# Altium project ImechE project.PrjPcb
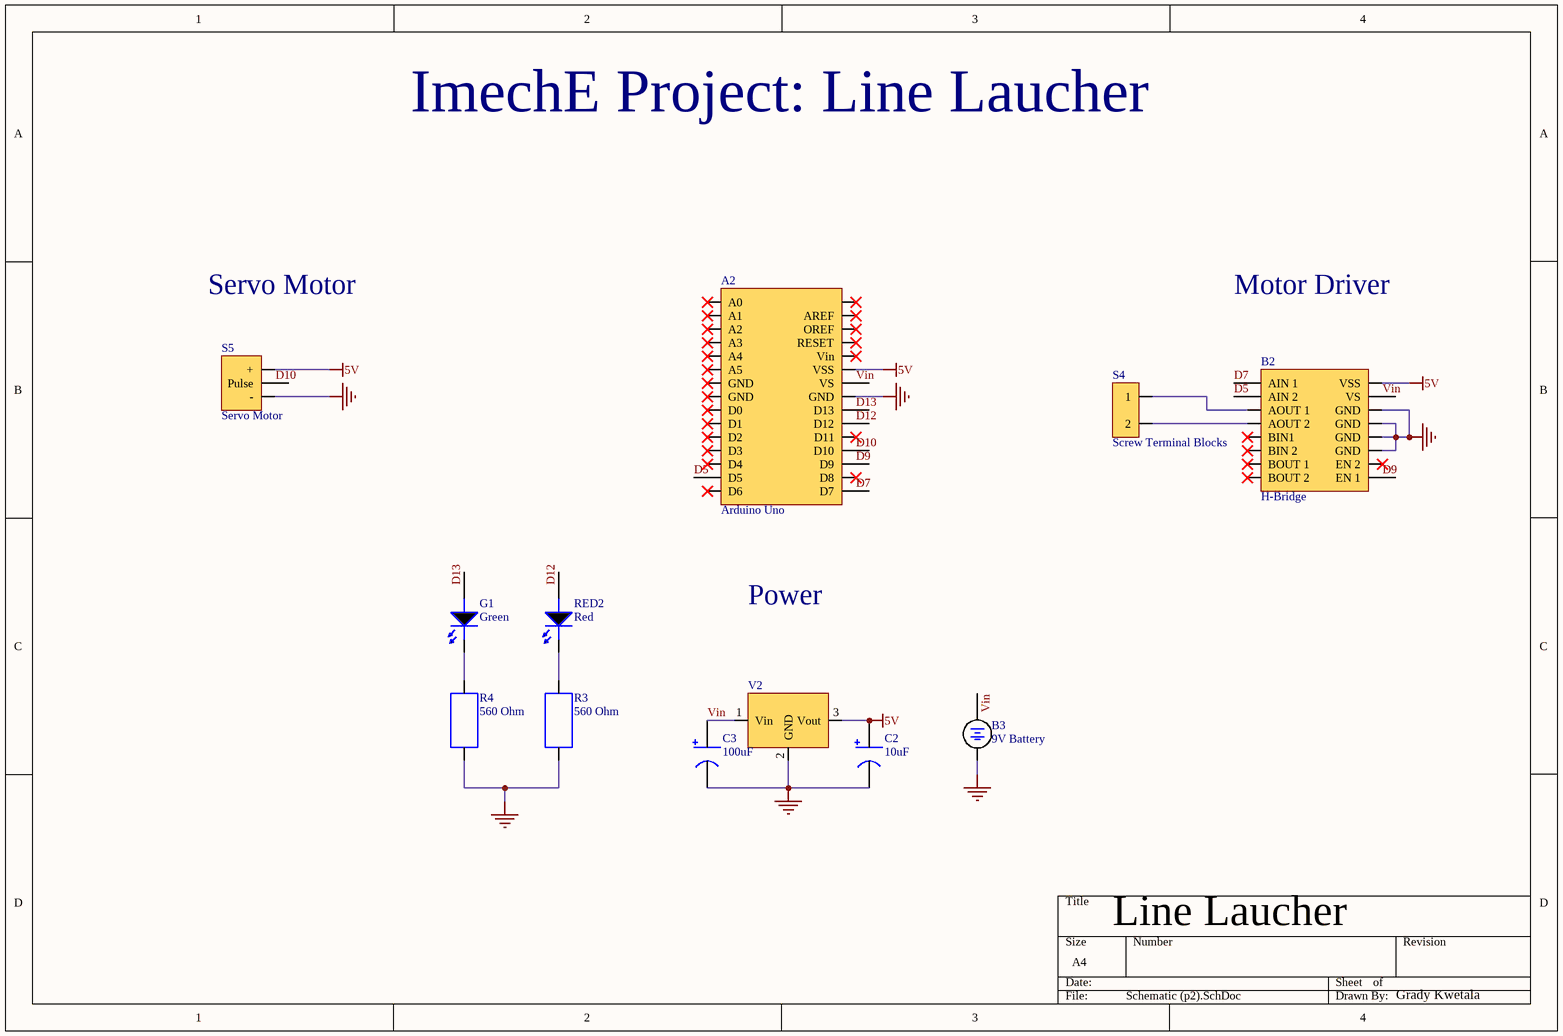
[diagram p0: Schematic (p2).SchDoc]
1 sheet, 12 parts. Net scope: global (net labels, ports and power ports of the same name join across sheets).
Board files: PCB.PcbDoc, PCB (p2).PcbDoc

## Sheet Schematic (p2).SchDoc
size A4

### Parts
A2  Arduino Uno  [Arduino Uno]
B2  H-Bridge  [H-Bridge]
B3  9V Battery  [9V Battery]
C2  10uF  [10uF]
C3  100uF  [100uF]
G1  Green  [Green]
R3  560 Ohm  [560]
R4  560 Ohm  [560]
RED2  Red  [RED]
S4  Screw Terminal Blocks  [Screw]
S5  Servo Motor  [Servo Motor]
V2  Voltage Regular  [Voltage regulator]  (value not drawn)

### Nets
5V: A2.25(VSS) B2.16(VSS) C2.2 S5.1(+) V2.3(Vout)
GND: A2.23(GND) B2.11(GND) B2.12(GND) B2.13(GND) B2.14(GND) B3.2(-) C2.1 C3.1 R3.1 R4.1 S5.3(-) V2.2(GND)
D5: A2.14(D5) B2.2(AIN_2)
D7: A2.16(D7) B2.1(AIN_1)
D9: A2.18(D9) B2.9(EN_1)
D10: A2.19(D10) S5.2(Pulse)
D12: A2.21(D12) RED2.2(+)
D13: A2.22(D13) G1.2(+)
Vin: A2.24(VS) B2.15(VS) B3.1(+) C3.2 V2.1(Vin)
NetB2_3: B2.3(AOUT_1) S4.1
NetB2_4: B2.4(AOUT_2) S4.2
NetG1_1: G1.1(-) R4.2
NetR3_2: R3.2 RED2.1(-)

Not connected (* = marked no-connect by the designer): A2 1(A0)* 2(A1)* 3(A2)* 4(A3)* 5(A4)* 6(A5)* 7(GND)* 8(GND)* 9(D0)* 10(D1)* 11(D2)* 12(D3)* 13(D4)* 15(D6)* 17(D8)* 20(D11)* 26(Vin)* 27(RESET)* 28(OREF)* 29(AREF)* 30*; B2 5(BIN1)* 6(BIN_2)* 7(BOUT_1)* 8(BOUT_2)* 10(EN_2)*

### Notes on the sheet
- ImechE Project: Line Laucher
- Servo Motor
- Motor Driver
- Power
- Line Laucher
- Grady Kwetala

### Library data of the parts
A2 = MSP430FR5739IDA: 16-bit Microcontrollers - MCU Mixed Signal MCU; Manufacturer: Texas Instruments; Number of I/Os: 30; RAM Size: 1KB; Interface: I2C,SPI,IrDA,UART,USART,LIN,SCI; Number of Timers/Counters: 5; Frequency: 24MHz; Max Supply Voltage: 3.6V; Min Supply Voltage: 2V; Number of ADC Channels: 14; Oscillator Type: Internal; Data Bus Width: 16b; Number of SPI Channels: 3; Number of I2C Channels: 1; Watchdog Timer: Yes; Number of GPIO: 33; Memory Type: FRAM,ROMless; Memory Size: 16KB; Number of UART Channels: 2; Peripherals: Brown-out Detect/Reset,POR,PWM,WDT; Core Architecture: MSP430; Manufacturer Part Number: MSP430FR5739IDA; RoHS: Yes; Case/Package: TSSOP; Number of Pins: 38; Min Operating Temperature: -40°C; Max Operating Temperature: 85°C; Packaging: Rail/Tube; Package Quantity: 40; Number of Programmable I/O: 30; Max Frequency: 24MHz; Number of A/D Converters: 14; Length: 12.6mm; Height: 1.05mm; Width: 6.2mm; Radiation Hardening: No; REACH SVHC: No SVHC; Lead Free: Lead Free; ComponentLink1URL: https://datasheet.ciiva.com/23612/1641704-23612987.pdf?src-supplier=Newark; ComponentLink1Description: https://datasheet.ciiva.com/23612/1641704-23612987.pdf?src-supplier=Newark; ComponentLink2URL: https://datasheet.ciiva.com/14380/msp430fr5720-14380986.pdf?src-supplier=Avnet; ComponentLink2Description: https://datasheet.ciiva.com/14380/msp430fr5720-14380986.pdf?src-supplier=Avnet; Supplier 1: Digi-Key; Supplier Part Number 1: 1050-1024-ND
B2 = SN754410NE: TEXAS INSTRUMENTS - SN754410NE - IC, PERIPHERAL DRIVER, HALF-H, 1A, DIP16; Number of Outputs: 4; Output Voltage: 36V; Output Current: 1.1A; Min Supply Voltage: 4.5V; Max Power Dissipation: 2.075W; Max Output Current: 2A; Supplier 1: Farnell; Manufacturer: Texas Instruments; Manufacturer Part Number: SN754410NE; Mount: Through Hole; Case/Package: PDIP; Number of Pins: 16; Weight: 0.03357oz; Contact Plating: Gold; Min Operating Temperature: -40°C; Max Operating Temperature: 85°C; Packaging: Rail/Tube; Package Quantity: 25; Max Supply Voltage: 36V; Number of Circuits: 4; Number of Drivers: 4; Length: 19.8mm; Height: 4.57mm; Width: 6.35mm; Radiation Hardening: No; REACH SVHC: No SVHC; Lead Free: Lead Free; ComponentLink1URL: http://www.ti.com/general/docs/lit/getliterature.tsp?genericPartNumber=SN754410&&fileType=pdf&src-supplier=Avnet; ComponentLink1Description: http://www.ti.com/general/docs/lit/getliterature.tsp?genericPartNumber=SN754410&&fileType=pdf&src-supplier=Avnet; ComponentLink2URL: https://www.verical.com/server-webapp/html/getDatasheet?partID=186188&src-supplier=Verical; ComponentLink2Description: https://www.verical.com/server-webapp/html/getDatasheet?partID=186188&src-supplier=Verical; ComponentLink3URL: http://www.jameco.com/Jameco/Products/ProdDS/1054684.pdf?src-supplier=Jameco; ComponentLink3Description: http://www.jameco.com/Jameco/Products/ProdDS/1054684.pdf?src-supplier=Jameco; ComponentLink4URL: http://www.rapidonline.com/pdf/82-0203.pdf?src-supplier=Rapid+Electronics; ComponentLink4Description: http://www.rapidonline.com/pdf/82-0203.pdf?src-supplier=Rapid+Electronics; ComponentLink5URL: http://focus.ti.com/lit/ds/symlink/sn754410.pdf?src-supplier=Avnet+Europe; ComponentLink5Description: http://focus.ti.com/lit/ds/symlink/sn754410.pdf?src-supplier=Avnet+Europe; Supplier Part Number 1: 3118977
B3 = 6LF22XWA/B: BATTERY ALKALINE 9V; Manufacturer: Panasonic; Supplier 1: Digi-Key; Supplier Part Number 1: P687-ND; Manufacturer Part Number: 6LF22XWA/B; Stock 1: 27519; Pricing 1: 1=1.90000, 10=1.58300, 50=1.37860, 210=1.30290, 420=1.21200, 630=1.14383, 1050=1.07565, 2520=1.00748 (USD); RoHS: No; Weight: 45.59g; Min Operating Temperature: -20°C; Max Operating Temperature: 54°C; Termination: Snap in; Package Quantity: 210; Voltage Rating: 9V; Chemistry/Technology: Alkaline; Packaging: Bulk; Output Voltage: 9V; Length: 1.91inch; Height: 0.69inch; Width: 0.51inch; Lead Free: Lead Free; ComponentLink1URL: http://www.mouser.com/ds/2/315/panasonic_alkaline_batteries_9v_series_6lf22xwa-541606.pdf?src-supplier=Mouser; ComponentLink1Description: http://www.mouser.com/ds/2/315/panasonic_alkaline_batteries_9v_series_6lf22xwa-541606.pdf?src-supplier=Mouser; ComponentLink2URL: https://na.industrial.panasonic.com/sites/default/pidsa/files/downloads/files/panasonic-6lf22xwa-datasheet.pdf?src-supplier=Digi-Key; ComponentLink2Description: https://na.industrial.panasonic.com/sites/default/pidsa/files/downloads/files/panasonic-6lf22xwa-datasheet.pdf?src-supplier=Digi-Key
C2 = UCY2G100MPD1TD: Cap Aluminum Lytic 10uF 400V 20% (10 X 16mm) Radial 5mm 150mA 8000h 105C Ammo Pack; Manufacturer: Nichicon; Life (Hours): 8000Hour; Lead Diameter: 0.6mm; Supplier 1: Digi-Key; Manufacturer Part Number: UCY2G100MPD1TD; Stock 1: 105637; Pricing 1: 1=0.84, 10=0.619, 100=0.4245 (USD); Mount: Through Hole; Case/Package: Radial; Min Operating Temperature: -40°C; Max Operating Temperature: 105°C; Package Quantity: 500; Packaging: Tape and Reel; Capacitance: 10uF; Tolerance: 20%; Voltage Rating: 400V; Ripple Current: 150mA; Termination: Radial; Diameter: 10mm; Height: 16mm; Lead Pitch: 5mm; Height - Seated (Max): 0.688inch; Radiation Hardening: No; Lead Free: Lead Free; ComponentLink1URL: http://nichicon-us.com/english/products/pdfs/e-mi_tape.pdf?src-supplier=Digi-Key; ComponentLink1Description: http://nichicon-us.com/english/products/pdfs/e-mi_tape.pdf?src-supplier=Digi-Key; Supplier Part Number 1: 493-13313-1-ND
G1 = LTST-C191KGKT: LED Uni-Color Green 574nm 2-Pin Chip LED T/R; Manufacturer: Vishay Lite-On; Lens Color: Colorless; Power Rating: 75mW; Luminous Intensity: 35mcd; Viewing Angle: 130°; Lens Style: Rectangular,Colorless; Forward Current: 30mA; Forward Voltage: 2V; Dominant Wavelength: 571nm; Test Current: 20mA; Lens Transparency: Clear; Number of Elements: 1; Reverse Voltage: 5V; Supplier 1: Digi-Key; Manufacturer Part Number: LTST-C191KGKT; Stock 1: 788187; Pricing 1: 1=0.28, 10=0.201, 100=0.0954, 500=0.06364, 1000=0.04984, 2500=0.04878 (USD); Mount: Surface Mount; Case/Package: 0603; Number of Pins: 2; Color: Green; Case Code (Metric): 1608; Case Code (Imperial): 0603; Min Operating Temperature: -55°C; Max Operating Temperature: 85°C; Packaging: Tape and Reel; Package Quantity: 1; Illumination Color: Green; Power Dissipation: 75mW; Wavelength: 574nm; Number of LEDs: 1; Max Power Dissipation: 75mW; Length: 1.6mm; Height: 0.55mm; Width: 0.8mm; Depth: 0.8mm; Radiation Hardening: No; Lead Free: Lead Free; ComponentLink1URL: http://optoelectronics.liteon.com/upload/download/DS22-2000-228/LTST-C191KGKT.PDF?src-supplier=Digi-Key; ComponentLink1Description: http://optoelectronics.liteon.com/upload/download/DS22-2000-228/LTST-C191KGKT.PDF?src-supplier=Digi-Key; Supplier Part Number 1: 160-1446-1-ND
R3 R4 = 1623252-1: Res Thick Film 0805 560 Ohm 1% 0.125W(1/8W) ±100ppm/°C Molded SMD; Manufacturer: TE Connectivity; Resistance: 560R; Max Power Dissipation: 125mW; Supplier 1: Digi-Key; Supplier Part Number 1: A126376CT-ND; Manufacturer Part Number: 1623252-1; Stock 1: 18530; Pricing 1: 1=0.10000, 10=0.04900, 100=0.02000, 1000=0.00898, 2500=0.00780 (USD); RoHS: Yes; Case/Package: 0805; Min Operating Temperature: -55°C; Max Operating Temperature: 125°C; Tolerance: 1%; Package Quantity: 5000; Packaging: Tape and Reel; Composition: Thick Film; Number of Terminations: 2; Temperature Coefficient: 100ppm/°C; Military Standard: Not; Length: 0.079inch; Height: 0.026inch; Width: 0.049inch; Depth: 1.25mm; Radiation Hardening: No; ComponentLink1URL: https://datasheet.ciiva.com/2530/eng-cd-1623252-ba-2530165.pdf?src-supplier=Digi-Key; ComponentLink1Description: https://datasheet.ciiva.com/2530/eng-cd-1623252-ba-2530165.pdf?src-supplier=Digi-Key; ComponentLink2URL: https://datasheet.ciiva.com/16904/eng-ds-1773204-f-16904630.pdf?src-supplier=Avnet+Europe; ComponentLink2Description: https://datasheet.ciiva.com/16904/eng-ds-1773204-f-16904630.pdf?src-supplier=Avnet+Europe; ComponentLink3URL: https://datasheet.ciiva.com/8903/eng-ds-1773204-f-8903597.pdf?src-supplier=Avnet; ComponentLink3Description: https://datasheet.ciiva.com/8903/eng-ds-1773204-f-8903597.pdf?src-supplier=Avnet
RED2 = HSMC-C190: AVAGO TECHNOLOGIES   HSMC-C190.   LED, SMD, RED; Manufacturer: Broadcom Avago; Lens Color: White; Luminous Intensity: 90mcd; Viewing Angle: 170°; Forward Voltage: 1.9V; Wavelength: 626nm; Lens Style: Rectangular,Diffused,Colorless; Power Dissipation: 60mW; Forward Current: 20mA; Lens Transparency: Diffused; Number of Elements: 1; Reverse Voltage: 5V; Supplier 1: RSComponents; Manufacturer Part Number: HSMC-C190; Mount: Surface Mount; Case/Package: 0603; Number of Pins: 2; Color: Red; Case Code (Metric): 1608; Case Code (Imperial): 0603; Min Operating Temperature: -40°C; Max Operating Temperature: 85°C; Packaging: Tape and Reel; Package Quantity: 1; Illumination Color: Red; Dominant Wavelength: 626nm; Test Current: 20mA; Voltage Rating (DC): 1.9V; Number of LEDs: 1; Power Rating: 60mW; Max Power Dissipation: 60mW; Length: 1.6mm; Height: 0.8mm; Depth: 0.8mm; Width: 0.8mm; Radiation Hardening: No; Lead Free: Lead Free; REACH SVHC: No SVHC; ComponentLink1URL: https://www.verical.com/server-webapp/html/getDatasheet?partID=128083&src-supplier=Verical; ComponentLink1Description: https://www.verical.com/server-webapp/html/getDatasheet?partID=128083&src-supplier=Verical; ComponentLink2URL: http://uk.rs-online.com/webdocs/0db8/0900766b80db8814.pdf?src-supplier=RSComponents; ComponentLink2Description: http://uk.rs-online.com/webdocs/0db8/0900766b80db8814.pdf?src-supplier=RSComponents; ComponentLink3URL: https://www.distrelec.biz/Web/Downloads/_t/ds/HSMx-C110-170-190-191-150_eng_tds.pdf?mime=application%2Fpdf&src-supplier=Distrelec; ComponentLink3Description: https://www.distrelec.biz/Web/Downloads/_t/ds/HSMx-C110-170-190-191-150_eng_tds.pdf?mime=application%2Fpdf&src-supplier=Distrelec; ComponentLink4URL: http://www.farnell.com/datasheets/55913.pdf?src-supplier=Element14; ComponentLink4Description: http://www.farnell.com/datasheets/55913.pdf?src-supplier=Element14; ComponentLink5URL: http://www.produktinfo.conrad.com/datenblaetter/175000-199999/180490-da-01-en-CHIP_LED_HSMC_C190_ROT.pdf?src-supplier=Conrad; ComponentLink5Description: http://www.produktinfo.conrad.com/datenblaetter/175000-199999/180490-da-01-en-CHIP_LED_HSMC_C190_ROT.pdf?src-supplier=Conrad; Supplier Part Number 1: 1278415P
S4 = 1988956: TERM BLOCK 2POS 45DEG 3.5MM PCB; Manufacturer: Phoenix Contact; Number of Poles: 2; Voltage Rating: 160V; Max Current Rating: 17.5A; Number of Levels: 1; Current: 10A; Voltage: 300V; Gender: Male; Wire Gauge (Max): 26AWG; Wire Gauge (Min): 16AWG; Approvals: UL; Supplier 1: RSComponents; Supplier Part Number 1: 7176659; Manufacturer Part Number: 1988956; RoHS: Yes; Mount: Through Hole; Number of Pins: 2; Weight: 0.034216oz; Color: Green; Material: Polyamide; Housing Color: Green; Housing Material: Polyamide; Contact Material: Tin; Package Quantity: 250; Packaging: Bulk; Number of Rows: 1; Max Supply Voltage: 160V; Current Rating: 17.5A; Number of Positions Per Level: 2; Termination: Screw; Number of Positions: 2; Number of Contacts: 2; Number of Circuits: 2; Orientation: Straight; Length: 7mm; Height: 11.2mm; Width: 13.7mm; Pitch: 3.5mm; Depth: 11.2mm; Lead Free: Lead Free; Flammability Rating: UL94 V-0; ComponentLink1URL: https://datasheet.ciiva.com/16051/1988956-16051359.pdf?src-supplier=Onlinecomponents.com; ComponentLink1Description: https://datasheet.ciiva.com/16051/1988956-16051359.pdf?src-supplier=Onlinecomponents.com; ComponentLink2URL: https://datasheet.ciiva.com/26340/567541-da-01-de-printklemme-1988956-250-st-26340451.pdf?src-supplier=Conrad; ComponentLink2Description: https://datasheet.ciiva.com/26340/567541-da-01-de-printklemme-1988956-250-st-26340451.pdf?src-supplier=Conrad; ComponentLink3URL: https://datasheet.ciiva.com/824/combiconcompactseries-824224.pdf?src-supplier=Digi-Key; ComponentLink3Description: https://datasheet.ciiva.com/824/combiconcompactseries-824224.pdf?src-supplier=Digi-Key; ComponentLink4URL: https://datasheet.ciiva.com/14609/70055171-14609100.pdf?src-supplier=Allied+Electronics; ComponentLink4Description: https://datasheet.ciiva.com/14609/70055171-14609100.pdf?src-supplier=Allied+Electronics
S5 = 900-00008: GEARMOTOR 6VDC SERVO; Manufacturer: Parallax; Operating Supply Voltage: 6V; Mounting Hole Spacing: 1.988inch; Approvals: CE; Supplier 1: RSComponents; Supplier Part Number 1: 7813046; Manufacturer Part Number: 900-00008; Stock 1: 60; Pricing 1: 1=12.03000, 5=11.56000, 10=11.07000 (GBP); RoHS: Yes; Weight: 0.094lb; Min Operating Temperature: -10°C; Max Operating Temperature: 50°C; Package Quantity: 1; Termination: Wire Leads; Length: 406mm; Height: 1inch; Width: 55.8mm; Depth: 19mm; ComponentLink1URL: https://datasheet.ciiva.com/4927/crservo-8470-4927809.pdf?src-supplier=Mouser; ComponentLink1Description: https://datasheet.ciiva.com/4927/crservo-8470-4927809.pdf?src-supplier=Mouser; ComponentLink2URL: https://datasheet.ciiva.com/30483/0900766b8123f8a1-30483945.pdf?src-supplier=RSComponents; ComponentLink2Description: https://datasheet.ciiva.com/30483/0900766b8123f8a1-30483945.pdf?src-supplier=RSComponents; ComponentLink3URL: https://datasheet.ciiva.com/27048/283039-27048842.pdf?src-supplier=Jameco; ComponentLink3Description: https://datasheet.ciiva.com/27048/283039-27048842.pdf?src-supplier=Jameco; ComponentLink4URL: https://datasheet.ciiva.com/3330/900-00008-eng-tds-3330493.pdf?src-supplier=Distrelec; ComponentLink4Description: https://datasheet.ciiva.com/3330/900-00008-eng-tds-3330493.pdf?src-supplier=Distrelec; ComponentLink5URL: https://datasheet.ciiva.com/2099/900-00008-continuous-rotation-servo-documentation-v2-2-2099203.pdf?src-supplier=Digi-Key; ComponentLink5Description: https://datasheet.ciiva.com/2099/900-00008-continuous-rotation-servo-documentation-v2-2-2099203.pdf?src-supplier=Digi-Key
V2 = L78M05CDT-TR: STMICROELECTRONICS   L78M05CDT-TR   LINEAR VOLTAGE REGULATOR, 5V, DPAK-3; Number of Outputs: 1; Min Input Voltage: 7V; Max Input Voltage: 35V; Output Current: 500mA; Dropout Voltage: 2V; Polarity: Positive; Quiescent Current: 6mA; Tolerance: 5%; Power Supply Rejection Ratio (PSRR): 62dB; Output Type: Fixed; Supplier 1: RSComponents; Manufacturer: STMicroelectronics; Manufacturer Part Number: L78M05CDT-TR; Mount: Surface Mount; Case/Package: TO-252; Number of Pins: 3; Weight: 0.01lb; Contact Plating: Tin,Matte; Min Operating Temperature: 0°C; Max Operating Temperature: 150°C; Packaging: Tape and Reel; Package Quantity: 1; Output Voltage: 5V; Nominal Output Voltage: 5V; Max Output Current: 500mA; Number of Regulators: 1; Min Output Voltage: 5V; Max Output Voltage: 5V; Length: 6.6mm; Height: 2.4mm; Width: 6.2mm; Radiation Hardening: No; REACH SVHC: No SVHC; Lead Free: Lead Free; ComponentLink1URL: http://www.mouser.com/ds/2/389/l78m-974157.pdf?src-supplier=Mouser; ComponentLink1Description: http://www.mouser.com/ds/2/389/l78m-974157.pdf?src-supplier=Mouser; ComponentLink2URL: http://www.st.com/web/en/resource/technical/document/datasheet/CD00000447.pdf?src-supplier=Future+Electronics; ComponentLink2Description: http://www.st.com/web/en/resource/technical/document/datasheet/CD00000447.pdf?src-supplier=Future+Electronics; ComponentLink3URL: http://www.st.com/content/ccc/resource/technical/document/datasheet/d7/5f/dc/5c/d5/b6/48/7c/CD00000447.pdf/files/CD00000447.pdf/jcr:content/translations/en.CD00000447.pdf?src-supplier=Digi-Key; ComponentLink3Description: http://www.st.com/content/ccc/resource/technical/document/datasheet/d7/5f/dc/5c/d5/b6/48/7c/CD00000447.pdf/files/CD00000447.pdf/jcr:content/translations/en.CD00000447.pdf?src-supplier=Digi-Key; ComponentLink4URL: https://www.verical.com/server-webapp/html/getDatasheet?partID=111001&src-supplier=Verical; ComponentLink4Description: https://www.verical.com/server-webapp/html/getDatasheet?partID=111001&src-supplier=Verical; ComponentLink5URL: https://www.distrelec.biz/Web/Downloads/ta/_e/tbL78MxxC_data_e.pdf?mime=application%2Fpdf&src-supplier=Distrelec; ComponentLink5Description: https://www.distrelec.biz/Web/Downloads/ta/_e/tbL78MxxC_data_e.pdf?mime=application%2Fpdf&src-supplier=Distrelec; ComponentLink6URL: http://www.farnell.com/datasheets/1834365.pdf?src-supplier=Element14; ComponentLink6Description: http://www.farnell.com/datasheets/1834365.pdf?src-supplier=Element14; ComponentLink7URL: http://www.jameco.com/Jameco/Products/ProdDS/2021024.pdf?src-supplier=Jameco; ComponentLink7Description: http://www.jameco.com/Jameco/Products/ProdDS/2021024.pdf?src-supplier=Jameco; ComponentLink8URL: http://www.produktinfo.conrad.com/datenblaetter/1100000-1199999/001184659-da-01-en-IC_REG_LDO_5V_L78M05CDT_TR_TO_252_3_STM.pdf?src-supplier=Conrad; ComponentLink8Description: http://www.produktinfo.conrad.com/datenblaetter/1100000-1199999/001184659-da-01-en-IC_REG_LDO_5V_L78M05CDT_TR_TO_252_3_STM.pdf?src-supplier=Conrad; Supplier Part Number 1: 2988592
C3 = 100uF: Supplier 1: Digi-Key; Supplier Part Number 1: 493-3938-6-ND